# Altium schematic sheet 26PinSuperseal.SchDoc
size A
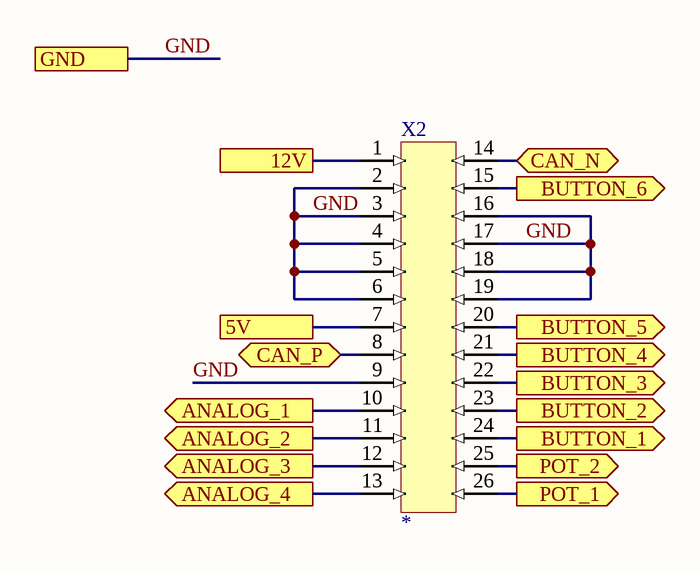
[diagram p0: 26PinSuperseal.SchDoc]

## Parts
X2  *  [TE_Amp_6437288-6]

## Ports
5V, 12V, ANALOG_1 (out), ANALOG_2 (out), ANALOG_3 (out), ANALOG_4 (out), BUTTON_1 (out), BUTTON_2 (out), BUTTON_3 (out), BUTTON_4 (out), BUTTON_5 (out), BUTTON_6 (out), CAN_N (bidir), CAN_P (bidir), GND, POT_1 (out), POT_2 (out)

## Nets
5V: X2.7 ; port 5V
12V: X2.1 ; port 12V
ANALOG_1: X2.10 ; port ANALOG_1
ANALOG_2: X2.11 ; port ANALOG_2
ANALOG_3: X2.12 ; port ANALOG_3
ANALOG_4: X2.13 ; port ANALOG_4
BUTTON_1: X2.24 ; port BUTTON_1
BUTTON_2: X2.23 ; port BUTTON_2
BUTTON_3: X2.22 ; port BUTTON_3
BUTTON_4: X2.21 ; port BUTTON_4
BUTTON_5: X2.20 ; port BUTTON_5
BUTTON_6: X2.15 ; port BUTTON_6
CAN_N: X2.14 ; port CAN_N
CAN_P: X2.8 ; port CAN_P
GND: X2.2 X2.3 X2.4 X2.5 X2.6 X2.9 X2.16 X2.17 X2.18 X2.19 ; port GND
POT_1: X2.26 ; port POT_1
POT_2: X2.25 ; port POT_2

## Library data of the parts
X2 = 7: AMP SuperSeal Straight; id: 7; name: 6437288-6; numcontacts: 26; numrows: 4; pitch: 3mm; MfrPartNo: *; quantity: 0; link: https://www.digikey.com/product-detail/en/te-connectivity-amp-connectors/6437288-6/A123256-ND/2329274